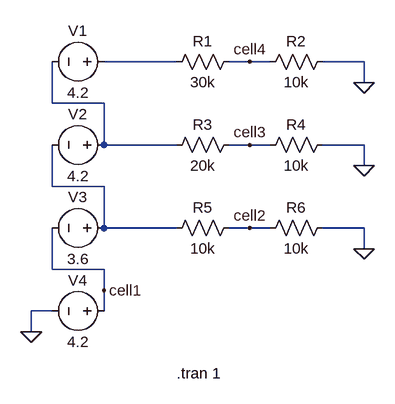
[diagram p0: schematic Battery_Mon_Sim.asc]
Battery_Mon_Sim.asc, the LTspice schematic file:
Version 4
SHEET 1 880 680
WIRE 192 80 80 80
WIRE 304 80 272 80
WIRE 336 80 304 80
WIRE 480 80 416 80
WIRE 480 112 480 80
WIRE 0 144 0 80
WIRE 80 144 0 144
WIRE 80 208 80 144
WIRE 192 208 80 208
WIRE 304 208 272 208
WIRE 336 208 304 208
WIRE 480 208 416 208
WIRE 480 240 480 208
WIRE 0 272 0 208
WIRE 80 272 0 272
WIRE 80 336 80 272
WIRE 192 336 80 336
WIRE 304 336 272 336
WIRE 336 336 304 336
WIRE 480 336 416 336
WIRE 480 368 480 336
WIRE 0 400 0 336
WIRE 80 400 0 400
WIRE 80 432 80 400
WIRE 0 464 -32 464
WIRE 80 464 80 432
WIRE -32 496 -32 464
FLAG -32 496 0
FLAG 480 368 0
FLAG 480 240 0
FLAG 480 112 0
FLAG 80 432 cell1
FLAG 304 336 cell2
FLAG 304 208 cell3
FLAG 304 80 cell4
SYMBOL voltage 96 80 R90
WINDOW 0 -32 56 VBottom 2
WINDOW 3 32 56 VTop 2
WINDOW 123 0 0 Left 0
WINDOW 39 0 0 Left 0
SYMATTR InstName V1
SYMATTR Value 4.2
SYMBOL voltage 96 208 R90
WINDOW 0 -32 56 VBottom 2
WINDOW 3 32 56 VTop 2
WINDOW 123 0 0 Left 0
WINDOW 39 0 0 Left 0
SYMATTR InstName V2
SYMATTR Value 4.2
SYMBOL voltage 96 336 R90
WINDOW 0 -32 56 VBottom 2
WINDOW 3 32 56 VTop 2
WINDOW 123 0 0 Left 0
WINDOW 39 0 0 Left 0
SYMATTR InstName V3
SYMATTR Value 3.6
SYMBOL voltage 96 464 R90
WINDOW 0 -32 56 VBottom 2
WINDOW 3 32 56 VTop 2
WINDOW 123 0 0 Left 0
WINDOW 39 0 0 Left 0
SYMATTR InstName V4
SYMATTR Value 4.2
SYMBOL res 288 64 R90
WINDOW 0 0 56 VBottom 2
WINDOW 3 32 56 VTop 2
SYMATTR InstName R1
SYMATTR Value 30k
SYMBOL res 432 64 R90
WINDOW 0 0 56 VBottom 2
WINDOW 3 32 56 VTop 2
SYMATTR InstName R2
SYMATTR Value 10k
SYMBOL res 288 192 R90
WINDOW 0 0 56 VBottom 2
WINDOW 3 32 56 VTop 2
SYMATTR InstName R3
SYMATTR Value 20k
SYMBOL res 432 192 R90
WINDOW 0 0 56 VBottom 2
WINDOW 3 32 56 VTop 2
SYMATTR InstName R4
SYMATTR Value 10k
SYMBOL res 288 320 R90
WINDOW 0 0 56 VBottom 2
WINDOW 3 32 56 VTop 2
SYMATTR InstName R5
SYMATTR Value 10k
SYMBOL res 432 320 R90
WINDOW 0 0 56 VBottom 2
WINDOW 3 32 56 VTop 2
SYMATTR InstName R6
SYMATTR Value 10k
TEXT 192 560 Left 2 !.tran 1

The netlist it stands for:
* Battery_Mon_Sim.asc
V1 N001 N002 4.2
V2 N002 N003 4.2
V3 N003 cell1 3.6
V4 cell1 0 4.2
R1 cell4 N001 30k
R2 0 cell4 10k
R3 cell3 N002 20k
R4 0 cell3 10k
R5 cell2 N003 10k
R6 0 cell2 10k
.tran 1
.backanno
.end